# Altium schematic sheet POWER.SchDoc: =ProjectName
size A3; Author: Ven
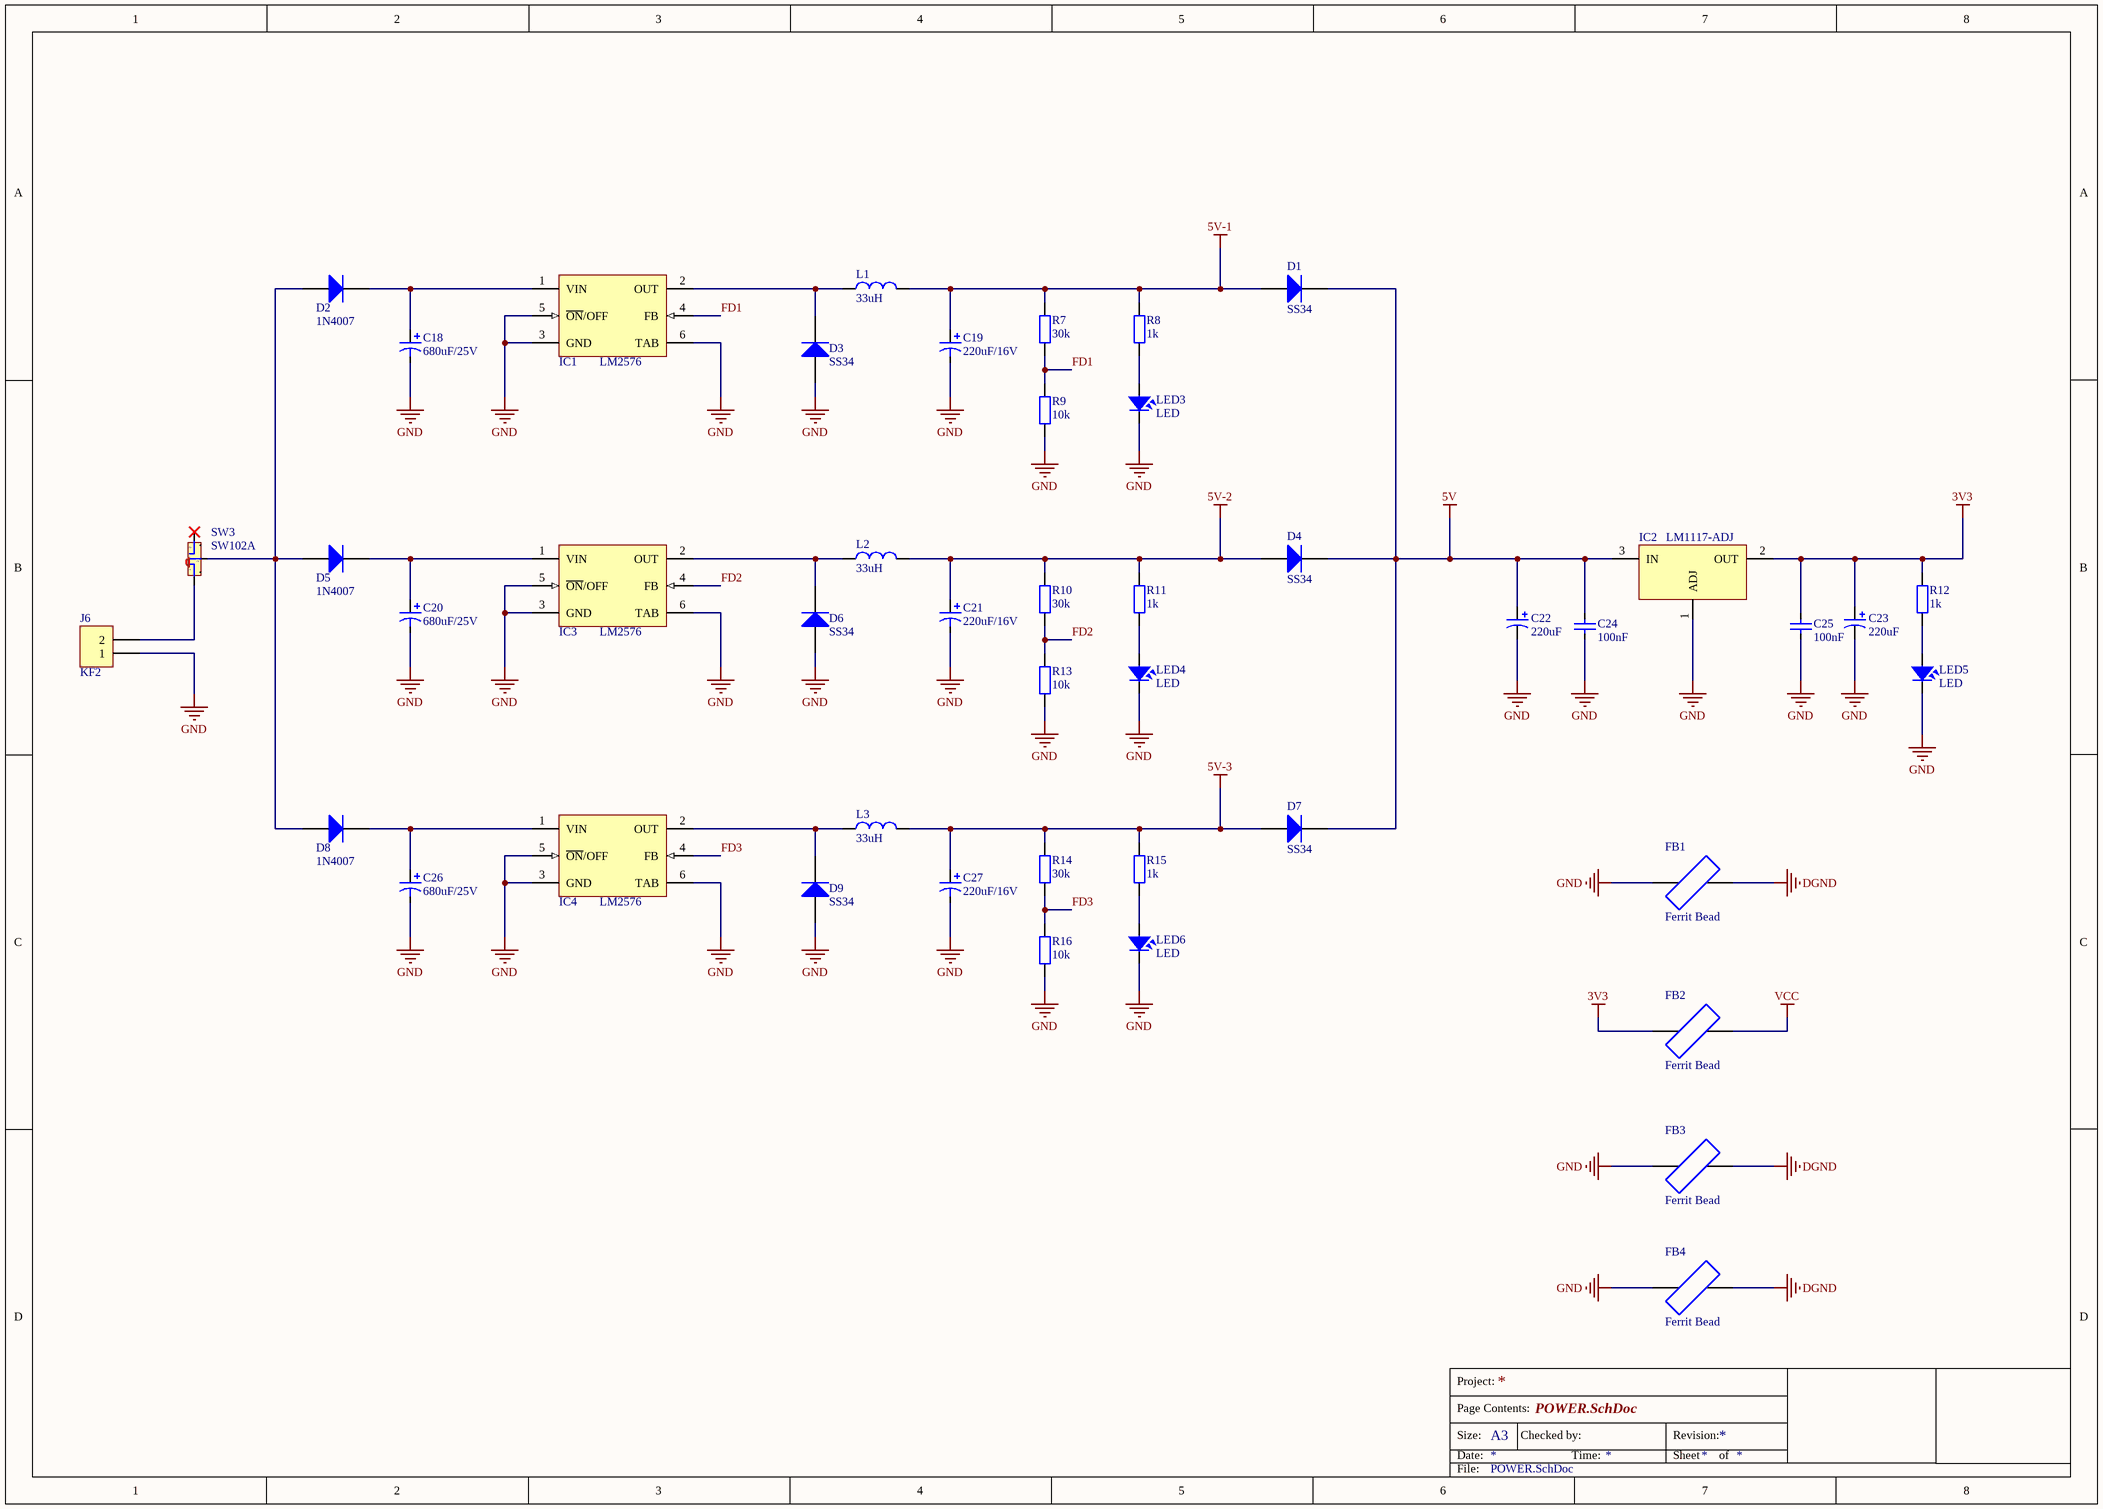
[diagram p0: POWER.SchDoc]

## Parts
C18  680uF/25V  [C10mm]
C19  220uF/16V  [C5mm]
C20  680uF/25V  [C10mm]
C21  220uF/16V  [C5mm]
C22  220uF  [CAP_7343]
C23  220uF  [CAP_7343]
C24  100nF  [CAP_0805]
C25  100nF  [CAP_0805]
C26  680uF/25V  [C10mm]
C27  220uF/16V  [C5mm]
D1  SS34  [DO-214AC(SMA)]
D2  1N4007  [DO-214AC(SMA)]
D3  SS34  [DO-214AC(SMA)]
D4  SS34  [DO-214AC(SMA)]
D5  1N4007  [DO-214AC(SMA)]
D6  SS34  [DO-214AC(SMA)]
D7  SS34  [DO-214AC(SMA)]
D8  1N4007  [DO-214AC(SMA)]
D9  SS34  [DO-214AC(SMA)]
FB1  Ferrit Bead  [RES-SMD-0805]
FB2  Ferrit Bead  [RES-SMD-0805]
FB3  Ferrit Bead  [RES-SMD-0805]
FB4  Ferrit Bead  [RES-SMD-0805]
IC1  LM2576  [TO263-5]
IC2  LM1117-ADJ  [LM1117-SOP]
IC3  LM2576  [TO263-5]
IC4  LM2576  [TO263-5]
J6  KF2  [KF2-5.08T]
L1  33uH  [L-SMD-M-12x10]
L2  33uH  [L-SMD-M-12x10]
L3  33uH  [L-SMD-M-12x10]
LED3  LED  [LED-0805-Red]
LED4  LED  [LED-0805-Red]
LED5  LED  [LED-0805-Blue]
LED6  LED  [LED-0805-Red]
R7  30k  [RES-SMD-0805]
R8  1k  [RES-SMD-0805]
R9  10k  [RES-SMD-0805]
R10  30k  [RES-SMD-0805]
R11  1k  [RES-SMD-0805]
R12  1k  [RES-SMD-0805]
R13  10k  [RES-SMD-0805]
R14  30k  [RES-SMD-0805]
R15  1k  [RES-SMD-0805]
R16  10k  [RES-SMD-0805]
SW3  SW102A  [SW102]

## Nets
3V3: C23.1 C25.2 FB2.1 IC2.2(OUT) R12.1
5V: C22.1 C24.2 D1.2(K) D4.2(K) D7.2(K) IC2.3(IN)
5V-1: C19.1 D1.1(A) L1.2 R7.1 R8.1
5V-2: C21.1 D4.1(A) L2.2 R10.1 R11.1
5V-3: C27.1 D7.1(A) L3.2 R14.1 R15.1
DGND: FB1.2 FB3.2 FB4.2
GND: C18.2 C19.2 C20.2 C21.2 C22.2 C23.2 C24.1 C25.1 C26.2 C27.2 D3.1(A) D6.1(A) D9.1(A) FB1.1 FB3.1 FB4.1 IC1.3(GND) IC1.5(~{ON}/OFF) IC1.6(TAB) IC2.1(ADJ) IC3.3(GND) IC3.5(~{ON}/OFF) IC3.6(TAB) IC4.3(GND) IC4.5(~{ON}/OFF) IC4.6(TAB) J6.1 LED3.2 LED4.2 LED5.2 LED6.2 R9.2 R13.2 R16.2
VCC: FB2.2
FD1: IC1.4(FB) R7.2 R9.1
FD2: IC3.4(FB) R10.2 R13.1
FD3: IC4.4(FB) R14.2 R16.1
NetC18_1: C18.1 D2.2(K) IC1.1(VIN)
NetC20_1: C20.1 D5.2(K) IC3.1(VIN)
NetC26_1: C26.1 D8.2(K) IC4.1(VIN)
NetD2_1: D2.1(A) D5.1(A) D8.1(A) SW3.2
NetD3_2: D3.2(K) IC1.2(OUT) L1.1
NetD6_2: D6.2(K) IC3.2(OUT) L2.1
NetD9_2: D9.2(K) IC4.2(OUT) L3.1
NetJ6_2: J6.2 SW3.1
NetLED3_1: LED3.1 R8.2
NetLED4_1: LED4.1 R11.2
NetLED5_1: LED5.1 R12.2
NetLED6_1: LED6.1 R15.2

Not connected (* = marked no-connect by the designer): SW3 3* 4 5

## Notes on the sheet
- Project:
- Page Contents:
- Size:
- Date:
- A3
- Checked by:
- Time:
- Revision:
- Sheet
- of
- File:

## Library data of the parts
C18-C21 C26 C27 = Cap Pol: Polarized Capacitor (Axial); Published: 8-Jun-2000; LatestRevisionDate: 17-Jul-2002; LatestRevisionNote: Re-released for DXP Platform.; PackageReference: POLAR0.8; Publisher: Altium Limited
C22 C23 = CAP_TAN_SMD: Polazied Tantalum Capacitor
C24 C25 = CapSMD: Capacitor; Value: 33p; Published: 8-Jun-2000; LatestRevisionDate: 17-Jul-2002; LatestRevisionNote: Re-released for DXP Platform.; PackageReference: RAD-0.3; Publisher: Altium Limited
D1-D9 = Diode SMD: Default Diode; Code - JEDEC: DO-214-AB; Value: 1N5007; Published: 8-Jun-2000; Revision: July-2002: Re-released for DXP Platform.; Publisher: Altium Limited
FB1-FB4 = Ferrit Bead: Generic Ferrit Bead
IC2 = LM1117-ADJ: 800mA Low-Dropout Linear Regulator; Creator: Nguyen Ba Bien; Website: http://group3i.net
J6 = KF2: Manufacturer: Würth Elektronik eiSos GmbH; partNo: 691103110002; ComponentLink1 Description: Manufacturer; ComponentLink2 Description: Datasheet; NoPins: 2; Created Date: 29 October 2013; ComponentLink1URL: http://www.we-online.com; ComponentLink2URL: http://katalog.we-online.de/em/datasheet/6911031100xx.pdf; Created by: Karrer Zheng
L1-L3 = Inductor: Value: 150 mH
LED3-LED6 = LED: LED Single colour Green and Red; Value: LED 3 ly Single Colour
R7-R16 = Resistor - SMD: Resistor SMD; Manufacturer: Generic Components; Class: Passive; Published: 08/06/2000; Publisher: Altium Hobart Technology Centre
SW3 = SW102A: Switch 102 on Broad; Value: Switch 102 On Board